# Altium schematic sheet TC2050-NL_TagConnect_10-pin.SchDoc: ESP32 JTAG Port
size A4
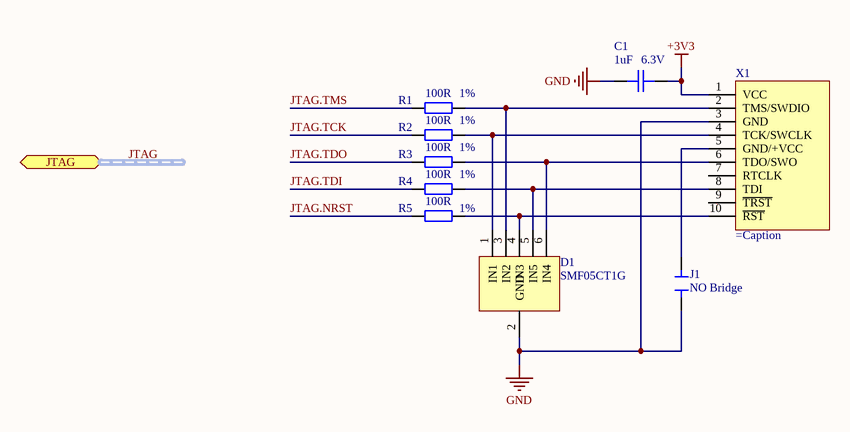
[diagram p0: TC2050-NL_TagConnect_10-pin.SchDoc]

## Parts
C1  Capacitance: 1uF  Voltage Rating: 6.3V  [C0402]  (hidden comment: CAP CER 1UF 6.3V X5R 0402)
D1  SMF05CT1G  [SOT363_SOP65P210X265-6N]
J1  NO Bridge  [NO_SolderBridge_0603]  (no BOM)
R1  Tolerance: 1%  Resistance: 100R  [R0402]  (hidden comment: RES SMD 100 OHM 1% 1/16W 0402)
R2  Tolerance: 1%  Resistance: 100R  [R0402]  (hidden comment: RES SMD 100 OHM 1% 1/16W 0402)
R3  Tolerance: 1%  Resistance: 100R  [R0402]  (hidden comment: RES SMD 100 OHM 1% 1/16W 0402)
R4  Tolerance: 1%  Resistance: 100R  [R0402]  (hidden comment: RES SMD 100 OHM 1% 1/16W 0402)
R5  Tolerance: 1%  Resistance: 100R  [R0402]  (hidden comment: RES SMD 100 OHM 1% 1/16W 0402)
X1  (no value)  [TC2050-IDC-NL]  (no BOM)

## Ports
JTAG (harness JTAG)

## Nets
+3V3: C1.2 X1.1(VCC)
GND: C1.1 D1.2(GND) J1.1 X1.3(GND)
JTAG.NRST: R5.2
JTAG.TCK: R2.2
JTAG.TDI: R4.2
JTAG.TDO: R3.2
JTAG.TMS: R1.2
NetD1_1: D1.1(IN1) R2.1 X1.4(TCK/SWCLK)
NetD1_3: D1.3(IN2) R1.1 X1.2(TMS/SWDIO)
NetD1_4: D1.4(IN3) R5.1 X1.10(~{RST})
NetD1_5: D1.5(IN5) R4.1 X1.8(TDI)
NetD1_6: D1.6(IN4) R3.1 X1.6(TDO/SWO)
NetJ1_2: J1.2 X1.5(GND/+VCC)

Not connected (* = marked no-connect by the designer): X1 7(RTCLK) 9(~{TRST})

## Buses and harness runs
harness JTAG = port JTAG

## Notes on the sheet
- Title
- Size:
- Date:
- A4
- Number:
- Time:
- Revision:
- Sheet
- of
- File:

## Library data of the parts
C1 = CAP CER 1UF 6.3V X5R 0402: 1µF ±10% 6.3V Ceramic Capacitor X5R 0402 (1005 Metric); Manufacturer: Yageo; Manufacturer Part Number: CC0402KRX5R5BB105; Supplier 1: Digi-Key; Stock 1: 34926286; Pricing 1: 1=0.1, 10=0.05, 50=0.0272, 100=0.0222, 500=0.0158, 1000=0.0124, 2500=0.0113, 5000=0.0104 (USD); Mount: Surface Mount; Number of Pins: 2; Case Code (Imperial): 0402; Case Code (Metric): 1005; Min Operating Temperature: -55°C; Max Operating Temperature: 85°C; Tolerance: 10%; Packaging: Tape and Reel; Termination: SMD/SMT; Voltage Rating (DC): 6.3V; Composition: Ceramic; Length: 1mm; Height: 0.5mm; Width: 0.02inch; Thickness: 0.022inch; Depth: 0.5mm; Radiation Hardening: No; Lead Free: Lead Free; Halogen Free: Halogen Free; ComponentLink1URL: http://www.farnell.com/datasheets/70765.pdf?src-supplier=Farnell; ComponentLink1Description: http://www.farnell.com/datasheets/70765.pdf?src-supplier=Farnell; Supplier Part Number 1: 311-1438-1-ND; Dielectric: X5R; Case/Package: 0402; Dielectric Material: Ceramic; Package Quantity: 1; REACH SVHC: No SVHC; ComponentLink2URL: http://www.yageo.com/documents/recent/UPY-GPHC_X5R_4V-to-50V_25.pdf?src-supplier=Digi-Key; ComponentLink2Description: http://www.yageo.com/documents/recent/UPY-GPHC_X5R_4V-to-50V_25.pdf?src-supplier=Digi-Key; ComponentLink3URL: http://www.farnell.com/datasheets/2167237.pdf?src-supplier=Element14; ComponentLink3Description: http://www.farnell.com/datasheets/2167237.pdf?src-supplier=Element14; ComponentLink4URL: http://www.yageo.com/documents/recent/UPY-GPHC_X5R_4V-to-50V_12.pdf?src-supplier=Avnet+Europe; ComponentLink4Description: http://www.yageo.com/documents/recent/UPY-GPHC_X5R_4V-to-50V_12.pdf?src-supplier=Avnet+Europe; ComponentLink5URL: http://www.farnell.com/datasheets/1359354.pdf?src-supplier=Element14; ComponentLink5Description: http://www.farnell.com/datasheets/1359354.pdf?src-supplier=Element14; ComponentLink6URL: http://www.farnell.com/datasheets/70765.pdf?src-supplier=Element14; ComponentLink6Description: http://www.farnell.com/datasheets/70765.pdf?src-supplier=Element14; ComponentLink7URL: http://www.yageo.com/documents/recent/UPY-GPHC_X5R_4V-to-50V_12.pdf?src-supplier=Avnet; ComponentLink7Description: http://www.yageo.com/documents/recent/UPY-GPHC_X5R_4V-to-50V_12.pdf?src-supplier=Avnet
D1 = TVS DIODE 5V 12.5V 5CH SC88: 12.5V Clamp 8A (8/20µs) Ipp Tvs Diode Surface Mount SC-88/SC70-6/SOT-363; Manufacturer: ON Semiconductor; Capacitance: 130pF; Direction: Unidirectional; Reverse Breakdown Voltage: 6.2V; Number of Elements: 5; Reverse Standoff Voltage: 5V; Peak Pulse Power: 100W; Power Line Protection: No; Leakage Current: 5uA; Test Current: 1mA; ESD Protection: Yes; Max Breakdown Voltage: 7.2V; Element Configuration: Common Anode; Supplier 1: Digi-Key; Manufacturer Part Number: SMF05CT1G; Stock 1: 33811; Pricing 1: 1=0.41, 10=0.307, 25=0.2768, 100=0.1459, 250=0.1444, 500=0.1293, 1000=0.1006 (USD); Case/Package: SC; Number of Pins: 6; Min Operating Temperature: -40°C; Max Operating Temperature: 125°C; Packaging: Tape and Reel; Number of Channels: 5; Min Breakdown Voltage: 6.2V; Clamping Voltage: 12.5V; Peak Pulse Current: 8A; Polarity: Unidirectional; Working Voltage: 5V; Max Reverse Leakage Current: 5uA; Max Power Dissipation: 100W; Breakdown Voltage: 6.2V; Voltage Rating (DC): 5V; Length: 2mm; Height: 1mm; Width: 1.25mm; Depth: 1.25mm; Radiation Hardening: No; REACH SVHC: No SVHC; Lead Free: Lead Free; ComponentLink1URL: http://www.farnell.com/datasheets/1708354.pdf?src-supplier=Element14; ComponentLink1Description: http://www.farnell.com/datasheets/1708354.pdf?src-supplier=Element14; ComponentLink2URL: http://www.onsemi.com/pub/Collateral/SMF05C-D.PDF?src-supplier=Digi-Key; ComponentLink2Description: http://www.onsemi.com/pub/Collateral/SMF05C-D.PDF?src-supplier=Digi-Key; ComponentLink3URL: http://www.mouser.com/ds/2/308/SMF05C-D-100912.pdf?src-supplier=Mouser; ComponentLink3Description: http://www.mouser.com/ds/2/308/SMF05C-D-100912.pdf?src-supplier=Mouser; ComponentLink4URL: http://www.onsemi.com/pub/Collateral/SMF05C-D.PDF?src-supplier=Avnet; ComponentLink4Description: http://www.onsemi.com/pub/Collateral/SMF05C-D.PDF?src-supplier=Avnet; ComponentLink5URL: https://www.verical.com/server-webapp/html/getDatasheet?partID=98371&src-supplier=Verical; ComponentLink5Description: https://www.verical.com/server-webapp/html/getDatasheet?partID=98371&src-supplier=Verical; Supplier Part Number 1: SMF05CT1GOSCT-ND; Contact Plating: Tin,Matte; Package Quantity: 1; Max Surge Current: 8A; Number of Unidirectional Channels: 5; Termination: SMD/SMT; Power Dissipation: 100W; Max Output Current: 8A; Composition: Zener; Mount: Surface Mount
J1 = NO Bridge: NO PCB Bridge (May be closed by a solder blob)
R1-R5 = RES SMD 100 OHM 1% 1/16W 0402: 100 Ohms ±1% 0.063W, 1/16W Chip Resistor 0402 (1005 Metric) Moisture Resistant Thick Film; Manufacturer: Yageo; Manufacturer Part Number: RC0402FR-07100RL; Power Rating: 62.5mW; Voltage Rating: 50V; Temperature Coefficient: 100ppm/°C; Supplier 1: Digi-Key; Stock 1: 16989760; Pricing 1: 1=0.1, 10=0.016, 100=0.0064, 1000=0.0029, 2500=0.0025, 5000=0.0021 (USD); Case/Package: 0402; Number of Pins: 2; Case Code (Imperial): 0402; Case Code (Metric): 1005; Min Operating Temperature: -55°C; Max Operating Temperature: 155°C; Voltage Rating (DC): 50V; Packaging: Tape and Reel; Termination: SMD/SMT; Composition: Thick Film; Military Standard: Not; Length: 1mm; Height: 0.32mm; Width: 0.5mm; Depth: 0.5mm; REACH SVHC: No SVHC; Lead Free: Lead Free; ComponentLink1URL: http://www.farnell.com/datasheets/2167052.pdf?src-supplier=Element14; ComponentLink1Description: http://www.farnell.com/datasheets/2167052.pdf?src-supplier=Element14; ComponentLink2URL: http://www.yageo.com/documents/recent/PYu-RC_Group_51_RoHS_L_9.pdf?src-supplier=Mouser; ComponentLink2Description: http://www.yageo.com/documents/recent/PYu-RC_Group_51_RoHS_L_9.pdf?src-supplier=Mouser; ComponentLink3URL: http://www.yageo.com/documents/recent/PYu-RC0402_51_RoHS_L_6_r.pdf?src-supplier=Future+Electronics; ComponentLink3Description: http://www.yageo.com/documents/recent/PYu-RC0402_51_RoHS_L_6_r.pdf?src-supplier=Future+Electronics; ComponentLink4URL: https://www.verical.com/server-webapp/html/getDatasheet?partID=329466&src-supplier=Verical; ComponentLink4Description: https://www.verical.com/server-webapp/html/getDatasheet?partID=329466&src-supplier=Verical; ComponentLink5URL: http://www.farnell.com/datasheets/1018594.pdf?src-supplier=Element14; ComponentLink5Description: http://www.farnell.com/datasheets/1018594.pdf?src-supplier=Element14; ComponentLink6URL: http://documents.rs-components.com/techlib://itc_doclist_GB.htm?stockno=6185810&src-supplier=RSComponents; ComponentLink6Description: http://documents.rs-components.com/techlib://itc_doclist_GB.htm?stockno=6185810&src-supplier=RSComponents; Supplier Part Number 1: 311-100LRDKR-ND; Mount: Surface Mount
X1 = TC2050-IDC-NL-JTAG: A connection to Plug-Of-Nails™ Adapter Cable